# Altium schematic sheet LCD_KEY.SchDoc
size A; SheetNumber: 4; SheetTotal: 8
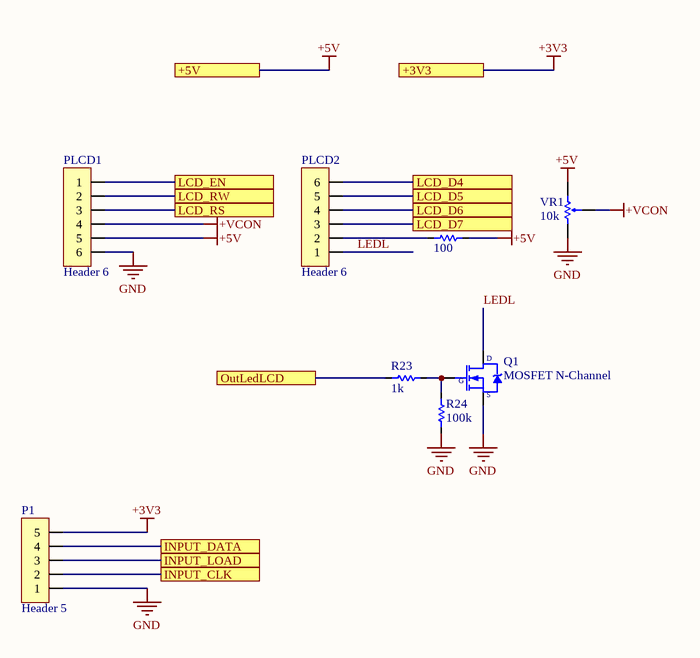
[diagram p0: LCD_KEY.SchDoc]

## Parts
P1  Header 5  [Header 5]
PLCD1  Header 6  [XH2.54-6P]
PLCD2  Header 6  [XH2.54-6P]
Q1  MOSFET N-Channel  [SOT-23]
R22  100  [R 0603 (1608)]
R23  1k  [R 0603 (1608)]
R24  100k  [R 0603 (1608)]
VR1  10k  [R VAR A]

## Ports
+3V3, +5V, INPUT_CLK, INPUT_DATA, INPUT_LOAD, LCD_D4, LCD_D5, LCD_D6, LCD_D7, LCD_EN, LCD_RS, LCD_RW, OutLedLCD

## Nets
+3V3: P1.5 ; port +3V3
+5V: PLCD1.5 R22.2 VR1.1 ; port +5V
+VCON: PLCD1.4 VR1.2
GND: P1.1 PLCD1.6 Q1.2(S) R24.1 VR1.3
INPUT_CLK: P1.2 ; port INPUT_CLK
INPUT_DATA: P1.4 ; port INPUT_DATA
INPUT_LOAD: P1.3 ; port INPUT_LOAD
LCD_D4: PLCD2.6 ; port LCD_D4
LCD_D5: PLCD2.5 ; port LCD_D5
LCD_D6: PLCD2.4 ; port LCD_D6
LCD_D7: PLCD2.3 ; port LCD_D7
LCD_EN: PLCD1.1 ; port LCD_EN
LCD_RS: PLCD1.3 ; port LCD_RS
LCD_RW: PLCD1.2 ; port LCD_RW
LEDL: PLCD2.1 Q1.3(D)
OutLedLCD: R23.1 ; port OutLedLCD
NetPLCD2_2: PLCD2.2 R22.1
NetQ1_1: Q1.1(G) R23.2 R24.2

## Library data of the parts
P1 = Header 5: Header, 5-Pin; LatestRevisionDate: 17-Jul-2002; LatestRevisionNote: Re-released for DXP Platform.; Publisher: Altium Limited
PLCD1 PLCD2 = Header 6: Header, 6-Pin
R22-R24 = Resistor: Published: 8-Jun-2000; LatestRevisionDate: 17-Jul-2002; LatestRevisionNote: Re-released for DXP Platform.; PackageReference: AXIAL-0.3; Publisher: Altium Limited
VR1 = Resistor Variable: Manufacturer: Omron Automation and Safety; Manufacturer Part Number: G3MB-202P DC5; Circuit: SPST-NO (1 Form A); Output Type: AC, Zero Cross; Load Current: 2A; Voltage - Input: 4 ~ 6VDC; Voltage - Load: 75 ~ 264 V; Relay Type: Relay; RoHS: RoHS Compliant; Category: Relays; Packaging: Bulk; Part Status: Obsolete; On-State Resistance (Max): -; Mounting Type: Through Hole; Termination Style: PC Pin; Package / Case: 4-SIP; Supplier Device Package: 4-SIP; ComponentLink1URL: http://media.digikey.com/pdf/Data%20Sheets/Omron%20PDFs/G3MB.pdf; ComponentLink1Description: http://media.digikey.com/pdf/Data%20Sheets/Omron%20PDFs/G3MB.pdf